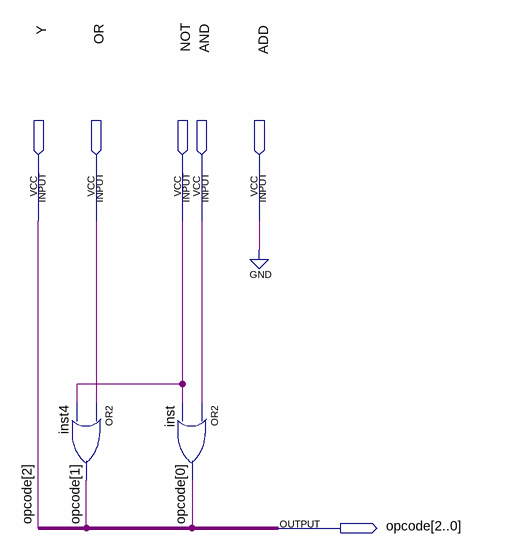
[diagram p0: schematic sheet]
// Quartus schematic decodula.bdf as structural Verilog: 2 symbols, 6 pins
module decodula (
  input  Y,
  input  OR,
  input  NOT,
  input  AND,
  input  ADD,
  output [2:0] opcode
);

  or inst4 (opcode[1], OR, NOT);
  or inst (opcode[0], AND, NOT);

  assign opcode[2] = Y;
  // also tied to GND on the sheet: ADD
endmodule
